# EAGLE schematic RgbwLedDriver (EAGLE 6.6.0)

## Sheet 1 of 3
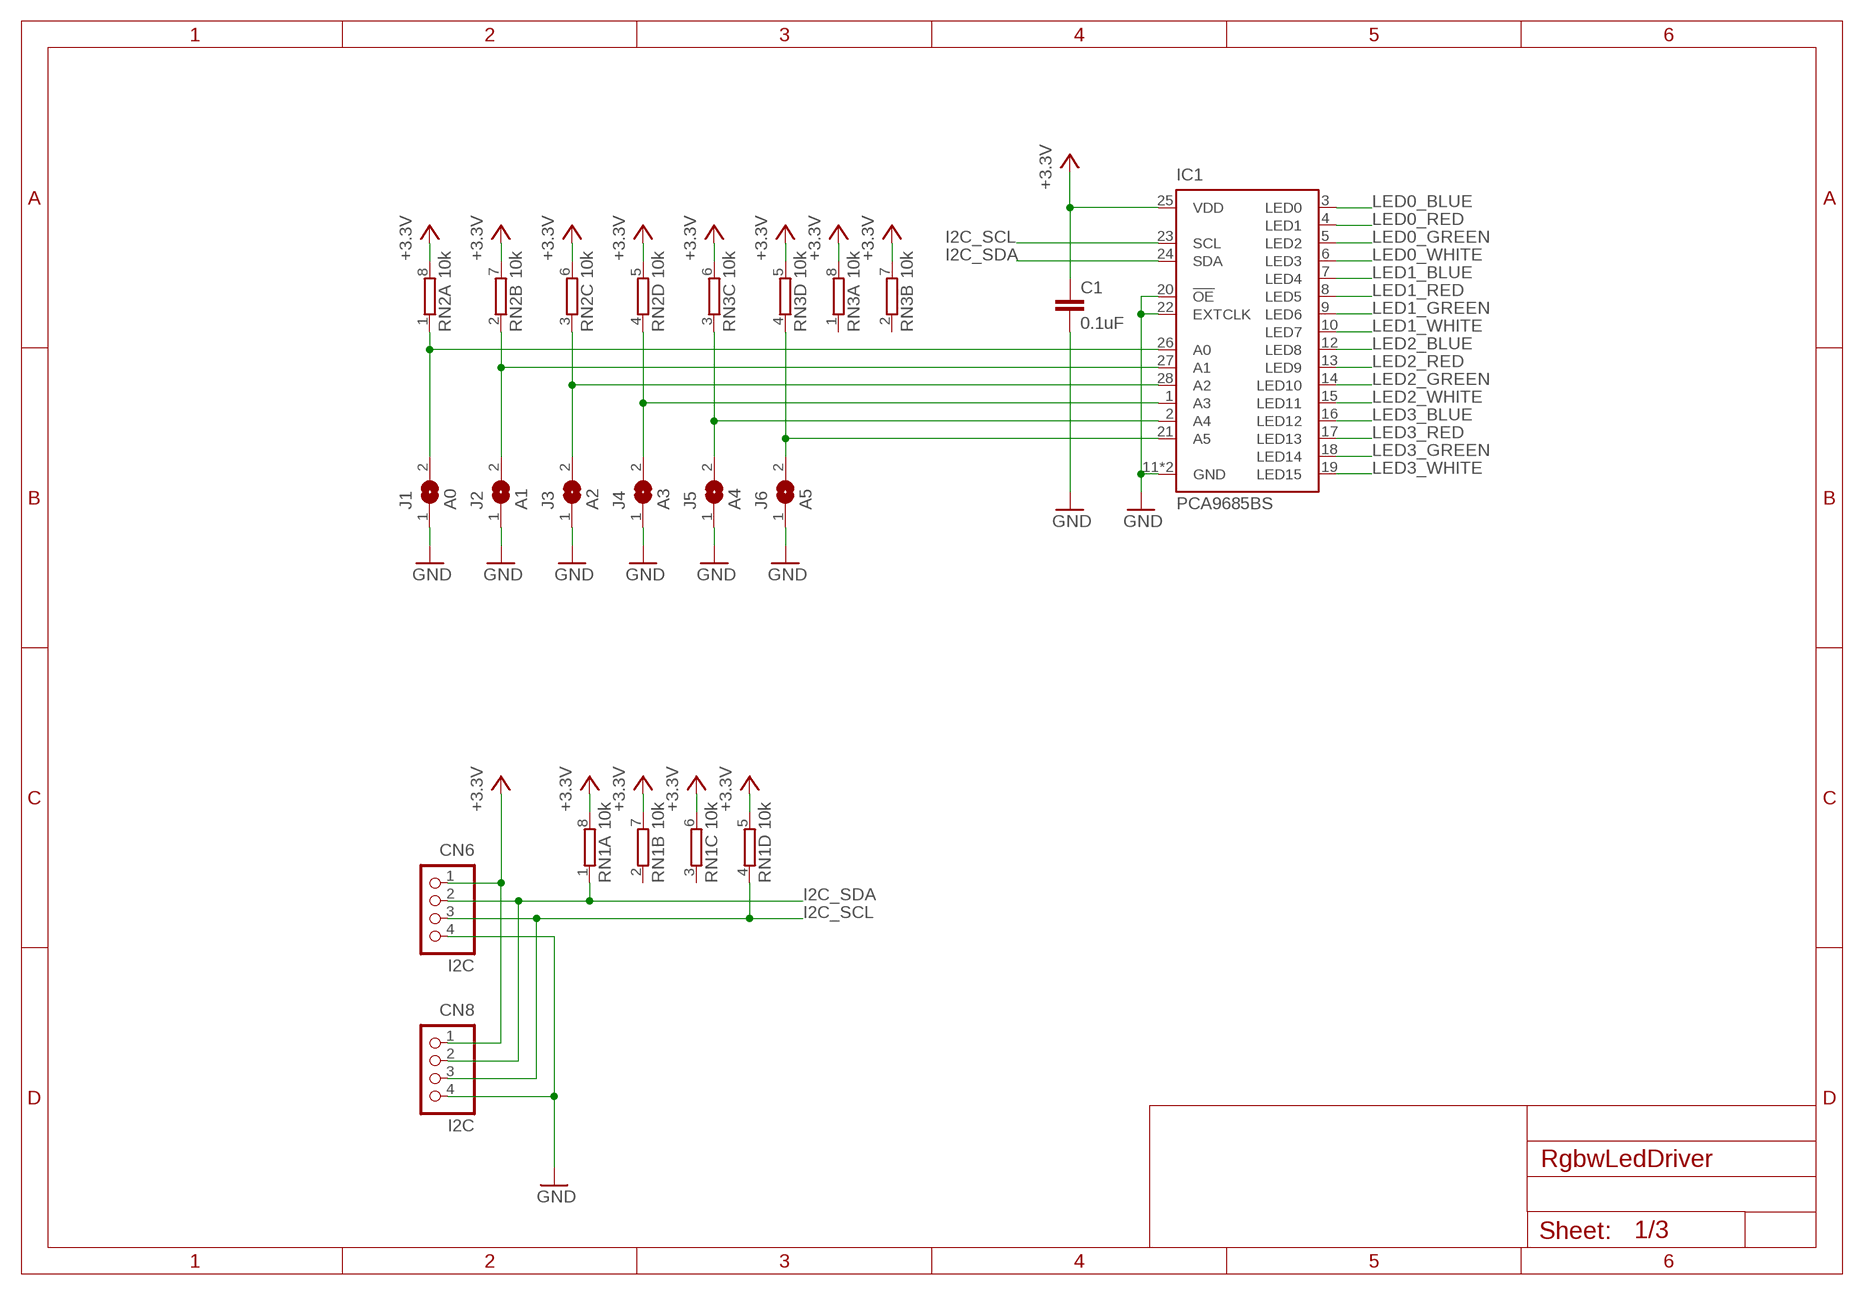
[diagram p0: schematic, sheet 1]

### Parts
C1  0.1uF  C-EUC0402  [C0402]
CN6  I2C  S4B-PH-K-S  [S4B-PH-K-S]
CN8  I2C  S4B-PH-K-S  [S4B-PH-K-S]
IC1  PCA9685BS  [QFN28-ML_6X6MM]
J1  A0  SJ  [SJ]
J2  A1  SJ  [SJ]
J3  A2  SJ  [SJ]
J4  A3  SJ  [SJ]
J5  A4  SJ  [SJ]
J6  A5  SJ  [SJ]
RN1  10k  4R-NEXB38V  [EXB38V]
RN2  10k  4R-NEXB38V  [EXB38V]
RN3  10k  4R-NEXB38V  [EXB38V]

### Nets
+3.3V: C1.1 CN6.1 CN8.1 IC1.25(VDD) RN1.5 RN1.6 RN1.7 RN1.8 RN2.5 RN2.6 RN2.7 RN2.8 RN3.5 RN3.6 RN3.7 RN3.8
GND: C1.2 CN6.4 CN8.4 IC1.11(GND) IC1.20(!OE!) IC1.22(EXTCLK) IC1.EXP(GND) J1.1 J2.1 J3.1 J4.1 J5.1 J6.1 ; also sheet 2,3
I2C_SCL: CN6.3 CN8.3 IC1.23(SCL) RN1.4
I2C_SDA: CN6.2 CN8.2 IC1.24(SDA) RN1.1
LED0_BLUE: IC1.3(LED0) ; also sheet 2
LED0_GREEN: IC1.5(LED2) ; also sheet 2
LED0_RED: IC1.4(LED1) ; also sheet 2
LED0_WHITE: IC1.6(LED3) ; also sheet 2
LED1_BLUE: IC1.7(LED4) ; also sheet 2
LED1_GREEN: IC1.9(LED6) ; also sheet 2
LED1_RED: IC1.8(LED5) ; also sheet 2
LED1_WHITE: IC1.10(LED7) ; also sheet 2
LED2_BLUE: IC1.12(LED8) ; also sheet 2
LED2_GREEN: IC1.14(LED10) ; also sheet 2
LED2_RED: IC1.13(LED9) ; also sheet 2
LED2_WHITE: IC1.15(LED11) ; also sheet 2
LED3_BLUE: IC1.16(LED12) ; also sheet 2
LED3_GREEN: IC1.18(LED14) ; also sheet 2
LED3_RED: IC1.17(LED13) ; also sheet 2
LED3_WHITE: IC1.19(LED15) ; also sheet 2
N$33: IC1.26(A0) J1.2 RN2.1
N$34: IC1.27(A1) J2.2 RN2.2
N$35: IC1.28(A2) J3.2 RN2.3
N$36: IC1.1(A3) J4.2 RN2.4
N$37: IC1.2(A4) J5.2 RN3.3
N$38: IC1.21(A5) J6.2 RN3.4
Unconnected: RN1.2 RN1.3 RN3.1 RN3.2

## Sheet 2 of 3
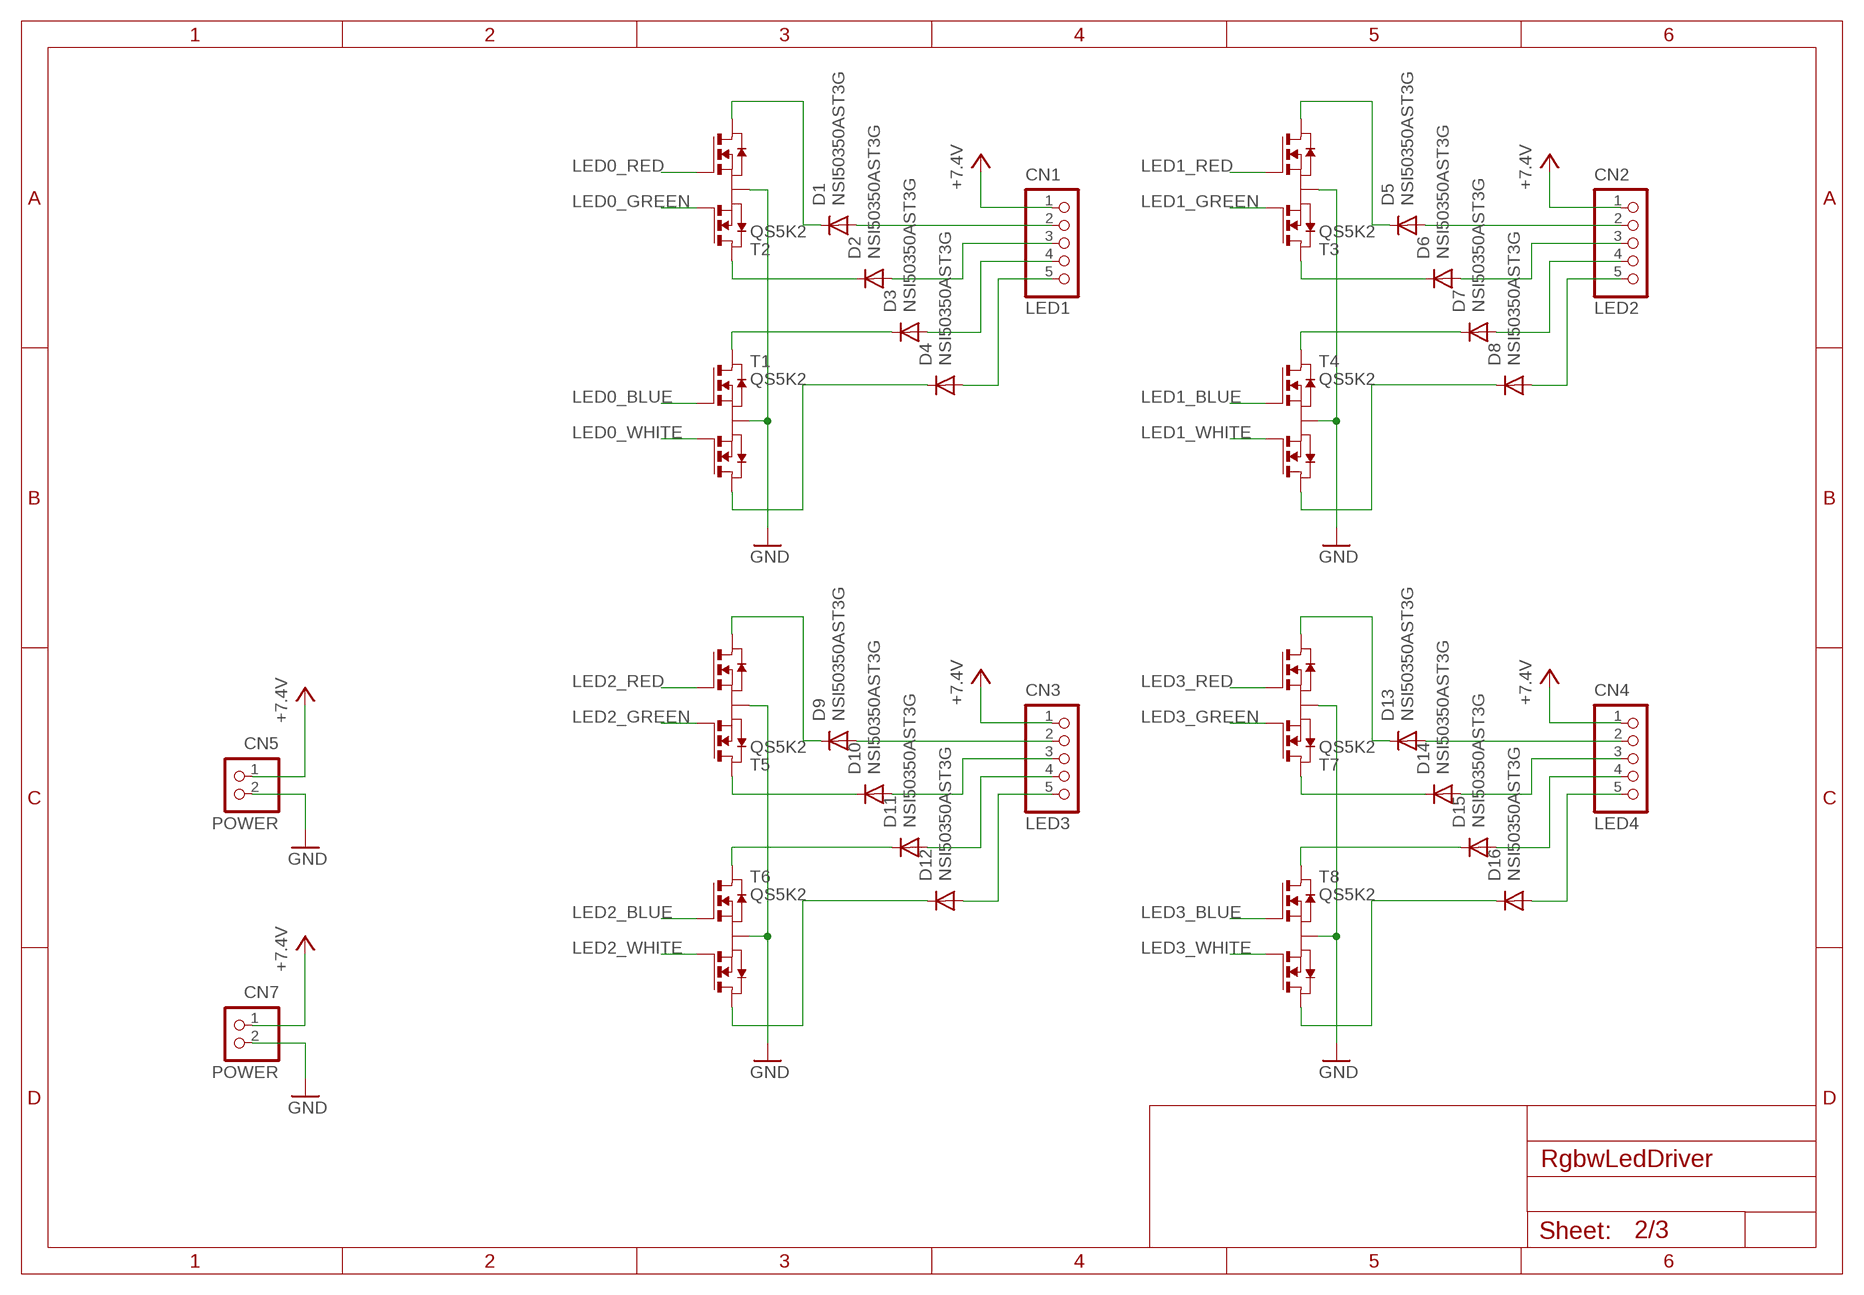
[diagram p1: schematic, sheet 2]

### Parts
CN1  LED1  S5B-PH-K-S  [S5B-PH-K-S]
CN2  LED2  S5B-PH-K-S  [S5B-PH-K-S]
CN3  LED3  S5B-PH-K-S  [S5B-PH-K-S]
CN4  LED4  S5B-PH-K-S  [S5B-PH-K-S]
CN5  POWER  B2P-VH  [B2P-VH]
CN7  POWER  B2P-VH  [B2P-VH]
D1  NSI50350AST3G  [SMC]
D2  NSI50350AST3G  [SMC]
D3  NSI50350AST3G  [SMC]
D4  NSI50350AST3G  [SMC]
D5  NSI50350AST3G  [SMC]
D6  NSI50350AST3G  [SMC]
D7  NSI50350AST3G  [SMC]
D8  NSI50350AST3G  [SMC]
D9  NSI50350AST3G  [SMC]
D10  NSI50350AST3G  [SMC]
D11  NSI50350AST3G  [SMC]
D12  NSI50350AST3G  [SMC]
D13  NSI50350AST3G  [SMC]
D14  NSI50350AST3G  [SMC]
D15  NSI50350AST3G  [SMC]
D16  NSI50350AST3G  [SMC]
T1  QS5K2  [SOT23-5L]
T2  QS5K2  [SOT23-5L]
T3  QS5K2  [SOT23-5L]
T4  QS5K2  [SOT23-5L]
T5  QS5K2  [SOT23-5L]
T6  QS5K2  [SOT23-5L]
T7  QS5K2  [SOT23-5L]
T8  QS5K2  [SOT23-5L]

### Nets
+7.4V: CN1.1 CN2.1 CN3.1 CN4.1 CN5.1 CN7.1
GND: CN5.2 CN7.2 T1.2(S) T2.2(S) T3.2(S) T4.2(S) T5.2(S) T6.2(S) T7.2(S) T8.2(S) ; also sheet 1,3
LED0_BLUE: T1.1(G1) ; also sheet 1
LED0_GREEN: T2.1(G1) ; also sheet 1
LED0_RED: T2.3(G2) ; also sheet 1
LED0_WHITE: T1.3(G2) ; also sheet 1
LED1_BLUE: T4.1(G1) ; also sheet 1
LED1_GREEN: T3.1(G1) ; also sheet 1
LED1_RED: T3.3(G2) ; also sheet 1
LED1_WHITE: T4.3(G2) ; also sheet 1
LED2_BLUE: T6.1(G1) ; also sheet 1
LED2_GREEN: T5.1(G1) ; also sheet 1
LED2_RED: T5.3(G2) ; also sheet 1
LED2_WHITE: T6.3(G2) ; also sheet 1
LED3_BLUE: T8.1(G1) ; also sheet 1
LED3_GREEN: T7.1(G1) ; also sheet 1
LED3_RED: T7.3(G2) ; also sheet 1
LED3_WHITE: T8.3(G2) ; also sheet 1
N$1: CN1.2 D1.A
N$2: D2.C T2.5(D1)
N$3: D6.C T3.5(D1)
N$4: D1.C T2.4(D2)
N$5: D4.C T1.4(D2)
N$6: CN1.3 D2.A
N$7: CN1.5 D4.A
N$8: CN1.4 D3.A
N$9: D3.C T1.5(D1)
N$10: D5.C T3.4(D2)
N$11: D8.C T4.4(D2)
N$12: CN2.2 D5.A
N$13: CN2.3 D6.A
N$14: CN2.5 D8.A
N$15: CN2.4 D7.A
N$16: D7.C T4.5(D1)
N$17: D10.C T5.5(D1)
N$18: D9.C T5.4(D2)
N$19: D12.C T6.4(D2)
N$20: CN3.2 D9.A
N$21: CN3.3 D10.A
N$22: CN3.5 D12.A
N$23: CN3.4 D11.A
N$24: D11.C T6.5(D1)
N$25: D14.C T7.5(D1)
N$26: D13.C T7.4(D2)
N$27: D16.C T8.4(D2)
N$28: CN4.2 D13.A
N$29: CN4.3 D14.A
N$30: CN4.5 D16.A
N$31: CN4.4 D15.A
N$32: D15.C T8.5(D1)

## Sheet 3 of 3: Mount Holes
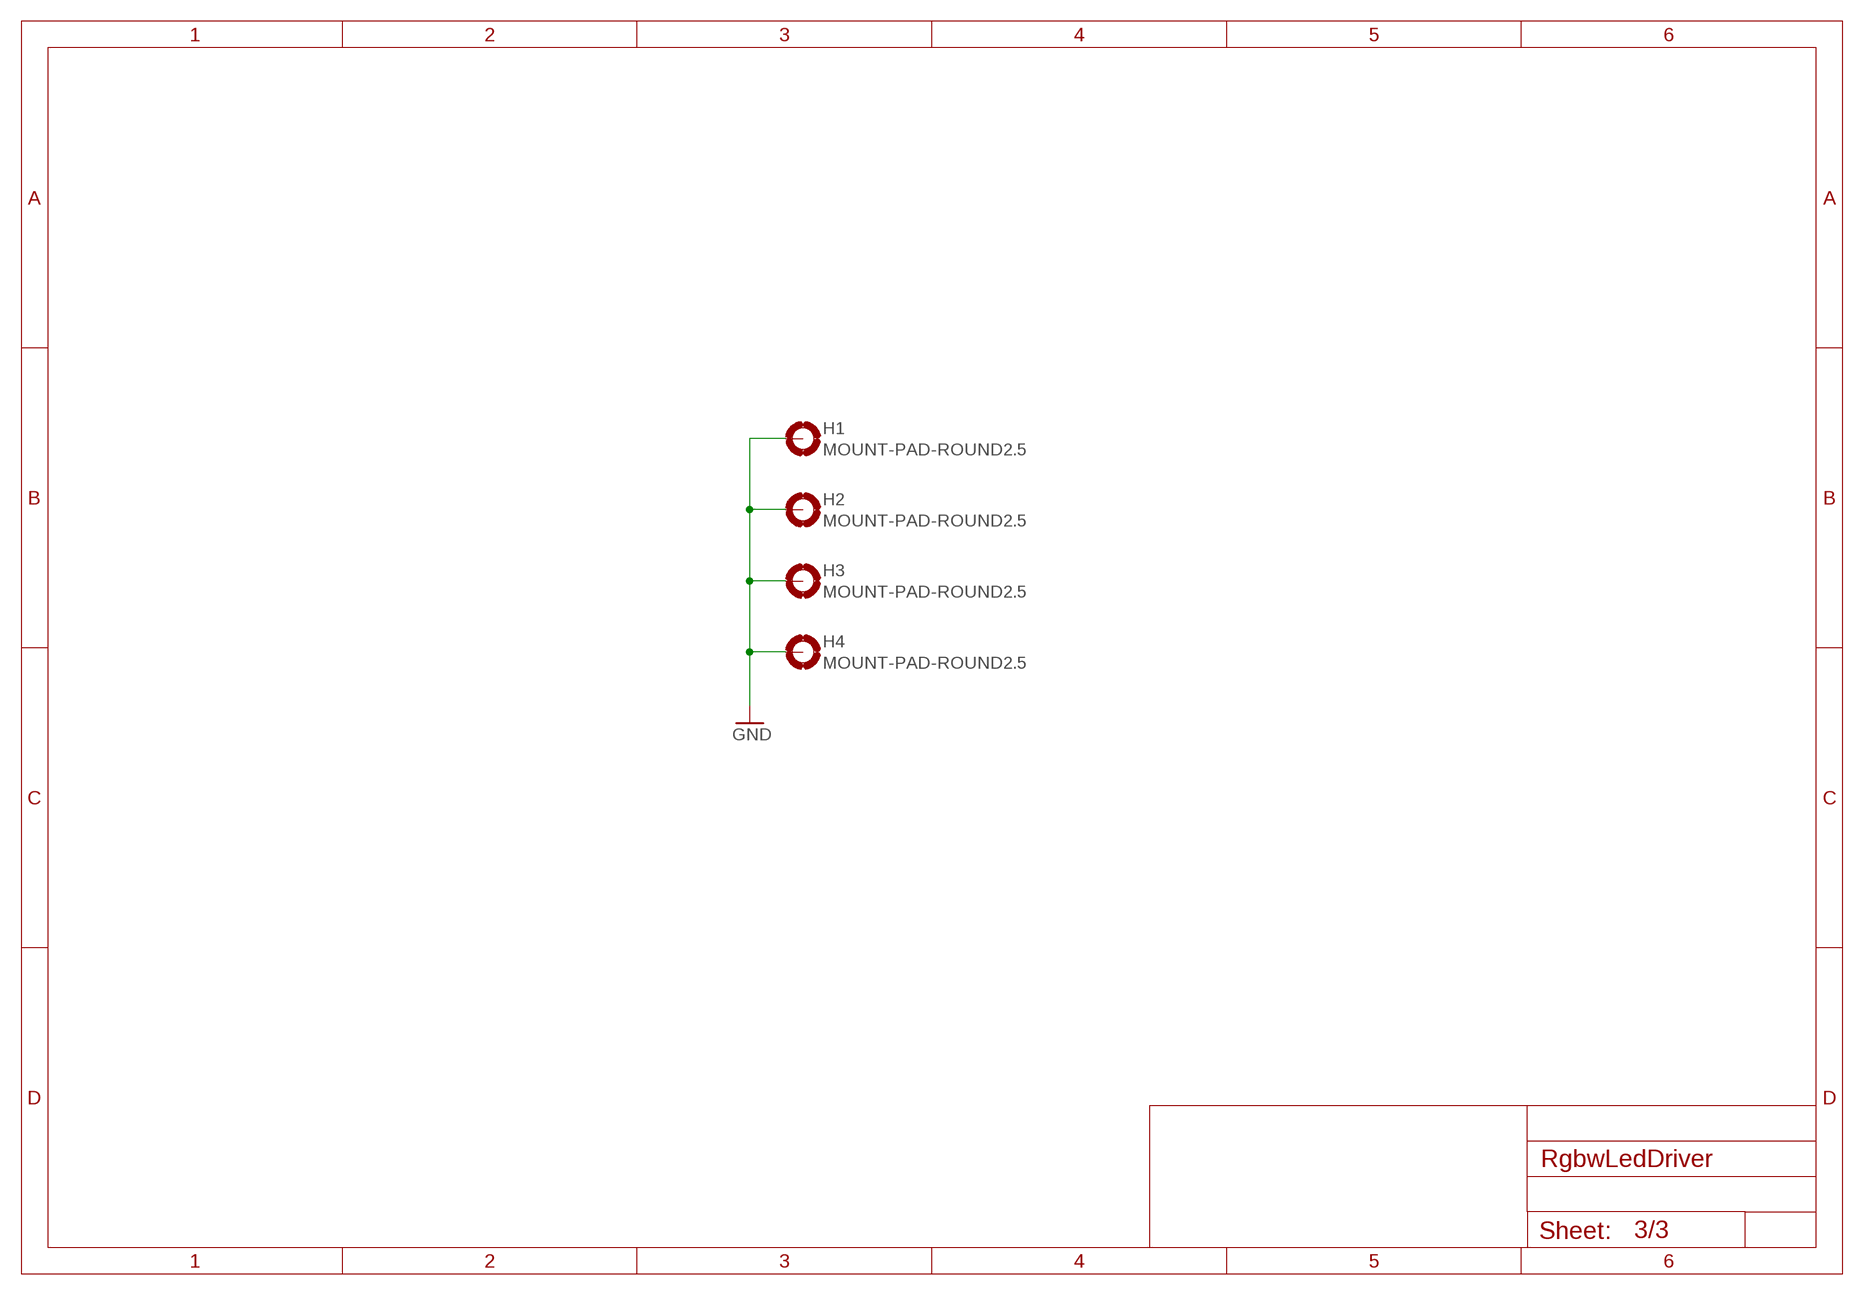
[diagram p2: schematic, sheet 3]

### Parts
H1  MOUNT-PAD-ROUND2.5  [2,5-PAD]
H2  MOUNT-PAD-ROUND2.5  [2,5-PAD]
H3  MOUNT-PAD-ROUND2.5  [2,5-PAD]
H4  MOUNT-PAD-ROUND2.5  [2,5-PAD]

### Nets
GND: H1.B2,5(MOUNT) H2.B2,5(MOUNT) H3.B2,5(MOUNT) H4.B2,5(MOUNT) ; also sheet 1,2

## Library data of the parts
C1 = resistor:C-EU: CAPACITOR, European symbol
CN1-CN4 = jst-ph:S5B-PH-*: Wire-to-Board 2.0mm pitch side mount connector Source: http://www.jst-mfg.com/product/pdf/jpn/PH.pdf http://www.jst-mfg.com/product/detail.php?series=199
CN5 CN7 = jst-vh:B2P-VH: Wire-to-Board 3.96mm pitch top mount connector Source: http://www.jst-mfg.com/product/pdf/jpn/VH.pdf http://www.jst-mfg.com/product/detail.php?series=262
CN6 CN8 = jst-ph:S4B-PH-*: Wire-to-Board 2.0mm pitch side mount connector Source: http://www.jst-mfg.com/product/pdf/jpn/PH.pdf http://www.jst-mfg.com/product/detail.php?series=199
D1-D16 = on-semiconductor:NSI50350AST3G: Constant Current Regulator & LED Driver 50 V, 350 mA ±10%, 5.8 W Package Source: http://www.onsemi.jp/pub_link/Collateral/NSI50350AS-D.PDF
H1-H4 = holes:MOUNT-PAD-ROUND: MOUNTING PAD, round
IC1 = nxp:PCA9685: 16-channel, 12-bit PWM Fm+ I2C-bus LED controller Source: http://www.jp.nxp.com/documents/data_sheet/PCA9685.pdf
J1-J6 = jumper:SJ: SMD solder JUMPER
RN1-RN3 = resistor-dil:4R-N: Array Chip Resistor Source: RS Component / Phycomp; OC_FARNELL: unknown; OC_NEWARK: unknown
T1-T8 = rohm:QS5K2: 2.5V Drive Nch+Nch MOSFET Source: http://rohmfs.rohm.com/en/products/databook/datasheet/discrete/transistor/mosfet/qs5k2.pdf